# EAGLE design UnitedRefrigerator (EAGLE 9.0.1)
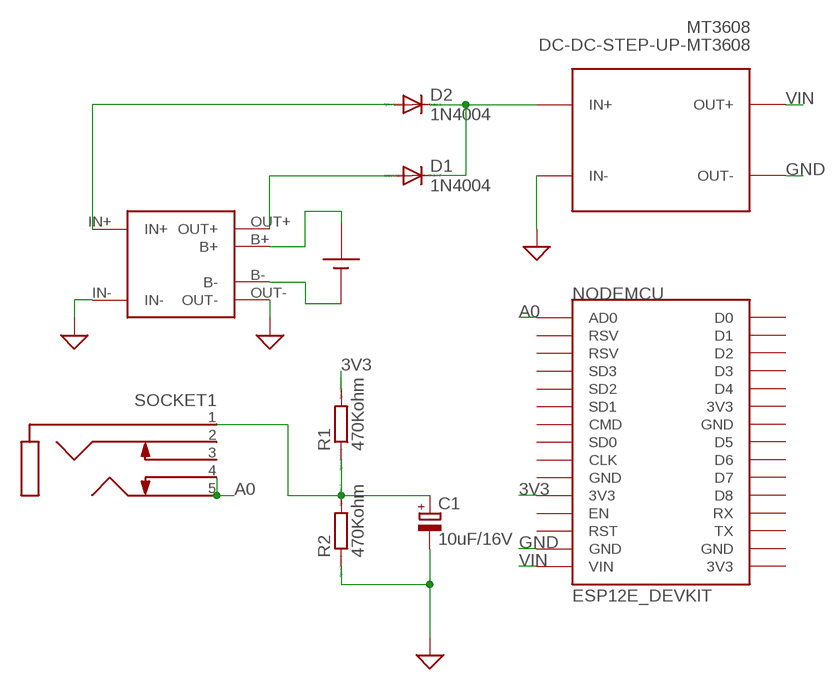
[diagram p0: schematic, sheet 1]

## Parts
C1  10uF/16V  CPOL-EUE2.5-6  [E2,5-6]
D1  1N4004  [DO41-10]
D2  1N4004  [DO41-10]
MT3608  DC-DC-STEP-UP-MT3608  [DC-DC-STEP-UP-MT3608]
NODEMCU  ESP12E_DEVKIT  [ESP12E_DEVKIT]
R1  470Kohm  R0204/7  [0204/7]
R2  470Kohm  R0204/7  [0204/7]
SOCKET1  STEREO_JACK3F07  [3.5AUDIO_3F07]
TP4056  TP4056-MODULE  [TP4056-LITHIUM-PROTECTED-MODULE]
U$3  18650CABLE  [18650-CASE-CABLE]

## Nets
3V3: NODEMCU.3V3@0(3V3) R1.2
A0: NODEMCU.AD0 SOCKET1.4(RSWITCH) SOCKET1.5(RING)
GND: C1.- MT3608.IN- MT3608.OUT- NODEMCU.GND@1(GND) R2.1 TP4056.IN- TP4056.OUT- ; supply symbol labelled SUP
N$1: C1.+ R1.1 R2.2 SOCKET1.1(SLEEVE)
N$3: TP4056.B- U$3.NEG
N$4: TP4056.B+ U$3.POS
N$5: D1.C D2.C MT3608.IN+
N$7: D2.A TP4056.IN+
N$8: D1.A TP4056.OUT+
VIN: MT3608.OUT+ NODEMCU.VIN
Unconnected: NODEMCU.3V3@1(3V3) NODEMCU.3V3@2(3V3) NODEMCU.CLK NODEMCU.CMD NODEMCU.D0 NODEMCU.D1 NODEMCU.D2 NODEMCU.D3 NODEMCU.D4 NODEMCU.D5 NODEMCU.D6 NODEMCU.D7 NODEMCU.D8 NODEMCU.EN NODEMCU.GND@0(GND) NODEMCU.GND@2(GND) NODEMCU.GND@3(GND) NODEMCU.RST NODEMCU.RSV@0(RSV) NODEMCU.RSV@1(RSV) NODEMCU.RX NODEMCU.SD0 NODEMCU.SD1 NODEMCU.SD2 NODEMCU.SD3 NODEMCU.TX SOCKET1.2(TIP) SOCKET1.3(TSWITCH)

## Library data of the parts
C1 = rcl:CPOL-EU: POLARIZED CAPACITOR, European symbol
D1 D2 = diode:1N4004: DIODE general purpose rectifier, 1 A
MT3608 = dc-dc-boost-2a-microusb-mt3608:DC-DC-STEP-UP-MT3608: DC/DC Step-Up Regulator based on MT3608 chip MT3608 datasheet available here: https://www.olimex.com/Products/Breadboarding/BB-PWR-3608/resources/MT3608.pdf Click here to find device on ebay.com <http://www.ebay.com/sch/mt3608+module>
NODEMCU = ESP12E_DEVKIT:ESP12E_DEVKIT: ESP12E DEVKIT BOARD
R1 R2 = eagle-ltspice:R: RESISTOR, European symbol; SPICEMODEL: NONE; SPICEPREFIX: R
SOCKET1 = bt_electromech:STEREO_JACK: 3.5mm Stereo Audio Jack with insert detect switches.
TP4056 = userlib:TP4056-MODULE
U$3 = userlib:18650: Lithium Ion 18650

## Net classes
0 default: width 0.635 mm, drill 0.508 mm, clearance 0.508 mm

## Board
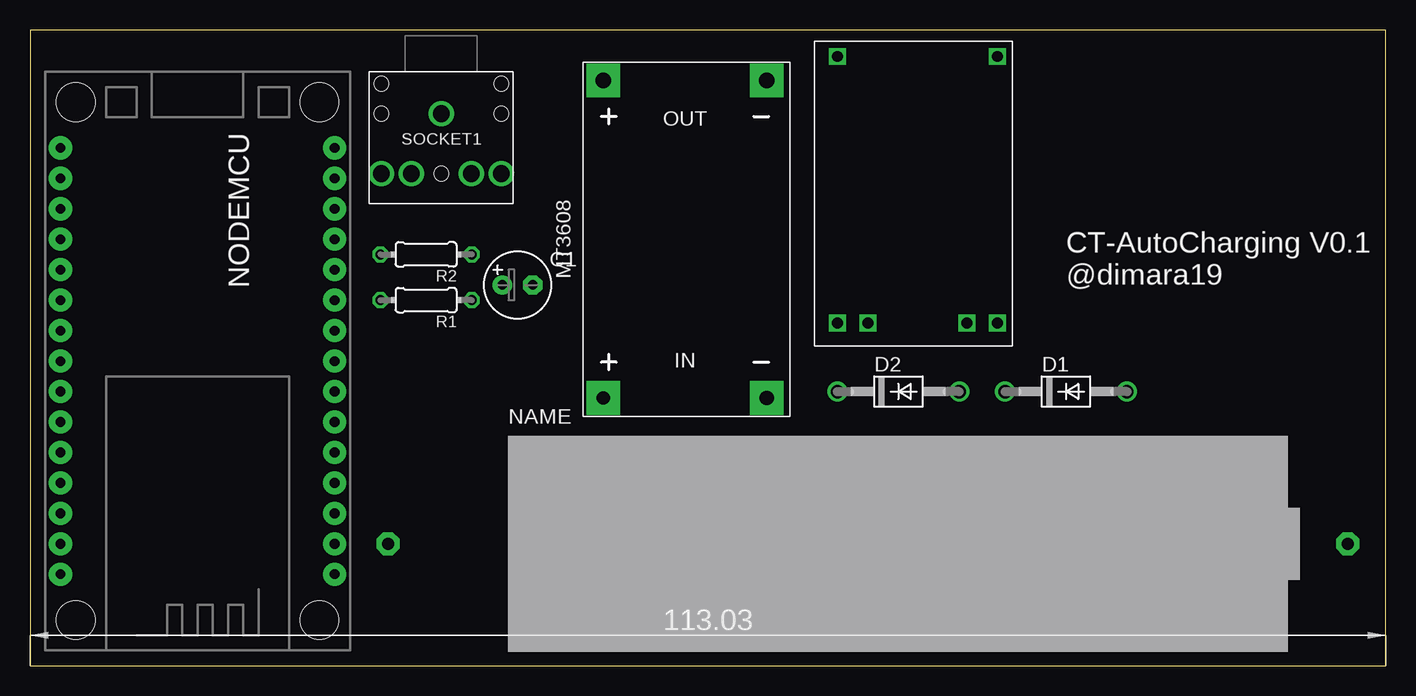
[diagram p1: board, top side]
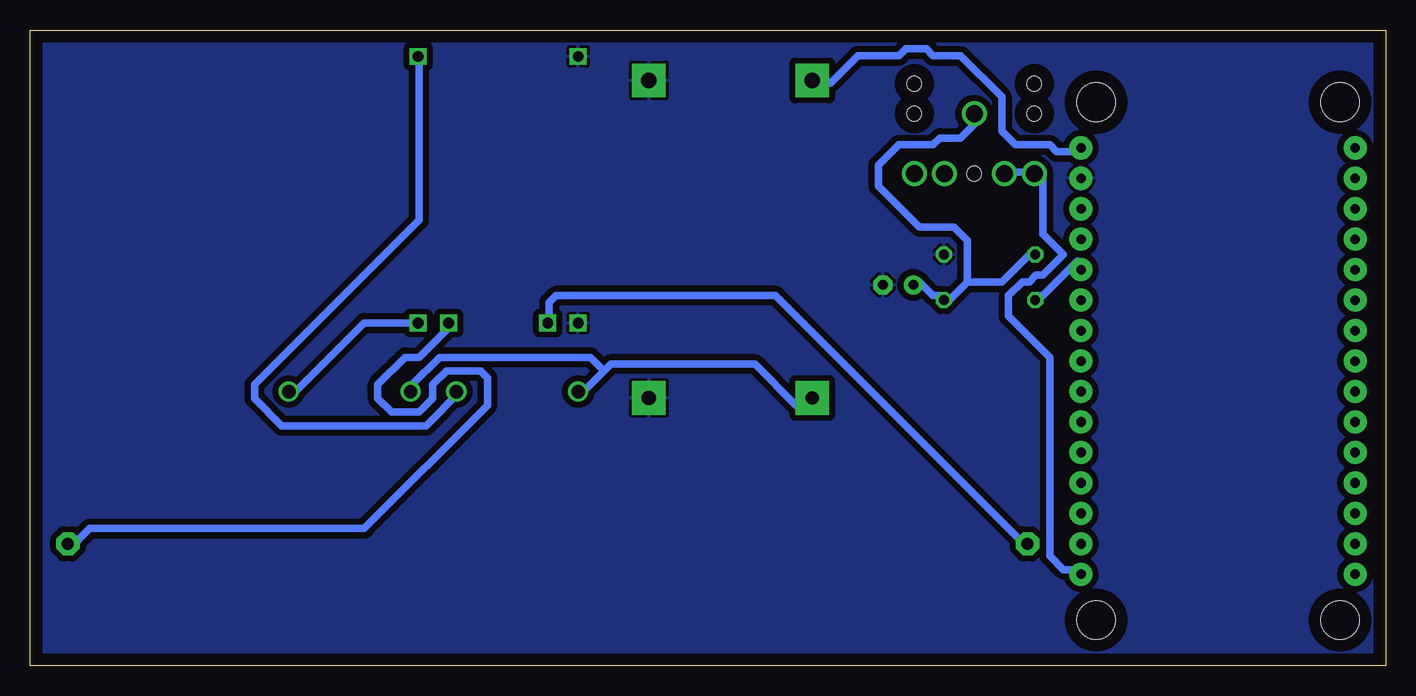
[diagram p2: board, bottom side, seen from below]

Size 113.01 x 53.01 mm. Coordinates in mm from the lower left corner, seen from the top.
Outline: 0,0 113.01,0 113.01,53.01 0,53.01 0,0
Copper layers (1*16): Top 0.035mm / dielectric 1.5mm / Bottom 0.035mm
Design rules "default": minimum track width 6mil, minimum drill 0.35mm, track to track 6mil, track to pad 6mil, pad to pad 6mil, via to via 6mil, smd to smd 6mil, copper to edge 40mil, drill to drill 6mil, minimum pad ring 10mil, minimum via ring 8mil, stop-mask expansion 4mil, vias tented up to drill 0mil, thermal gap 10mil

### Footprints (pad centres in the part's own frame; a part is rotated, then mirrored left to right if it is on the bottom)
E2,5-6 = drill 0.813 pad 1.6: + -1.27,0 | drill 0.813 pad 1.6 octagon: - 1.27,0
DO41-10 = drill 1.118: A 5.08,0; C -5.08,0
DC-DC-STEP-UP-MT3608 = drill 1.1 pad 2.8 square: IN+ -13.24,6.81 | drill 1.2 pad 2.8 square: IN- -13.24,-6.81 | drill 1.3 pad 2.8 square: OUT+ 13.24,6.81; OUT- 13.24,-6.81
ESP12E_DEVKIT = drill 0.8 pad 1.93: 3V3@0 -11.43,-7.62; 3V3@1 11.43,5.08; 3V3@2 11.43,-17.78; AD0 -11.43,17.78; CLK -11.43,-2.54; CMD -11.43,2.54; D0 11.43,17.78; D1 11.43,15.24; D2 11.43,12.7; D3 11.43,10.16; D4 11.43,7.62; D5 11.43,0; D6 11.43,-2.54; D7 11.43,-5.08; D8 11.43,-7.62; EN -11.43,-10.16; GND@0 -11.43,-5.08; GND@1 -11.43,-15.24; GND@2 11.43,2.54; GND@3 11.43,-15.24; RST -11.43,-12.7; RSV@0 -11.43,15.24; RSV@1 -11.43,12.7; RX 11.43,-10.16; SD0 -11.43,0; SD1 -11.43,5.08; SD2 -11.43,7.62; SD3 -11.43,10.16; TX 11.43,-12.7; VIN -11.43,-17.78 | hole 3.2: -10.16,21.59; 10.16,21.59; 10.16,-21.59; -10.16,-21.59
0204/7 = drill 0.813 octagon: 1 -3.81,0; 2 3.81,0
3.5AUDIO_3F07 = drill 1.4: 1 0,3.5; 2 -5,8.5; 3 -2.5,8.5; 4 2.5,8.5; 5 5,8.5 | hole 1.2: -5,3.5; -5,1; 5,1; 5,3.5; 0,8.5
TP4056-LITHIUM-PROTECTED-MODULE = drill 0.9 square: B+ 10.795,4.445; B- 10.795,-3.81; IN+ -11.43,6.985; IN- -11.43,-6.35; OUT+ 10.795,6.985; OUT- 10.795,-6.35
18650-CASE-CABLE = drill 1 pad 1.93 octagon: NEG -40,0; POS 40,0

### Placement (x,y rotation side)
C1  40.64,31.75 0 top
D1  86.36,22.86 0 top
D2  72.39,22.86 0 top
MT3608  54.61,35.56 90 top
NODEMCU  13.97,25.4 180 top
R1  33.02,30.48 180 top
R2  33.02,34.29 180 top
SOCKET1  34.29,49.53 180 top
TP4056  73.66,39.37 270 top
U$3  69.85,10.16 0 top

### Tracks (layer width: path | path; a pad name or v marks a point on that pad's centre or on a via)
3V3
  Bottom 0.635: R1.2 29.15,30.86 28.57,30.86 25.72,33.72 25.15,33.15 NODEMCU.3V3@0
A0
  Bottom 0.635: NODEMCU.AD0 25.72,8 26.86,8 28,9.14 28,25.72 31.43,29.15 31.43,30.86 30.29,32 29.72,32 29.15,32.58 28.57,32.58 26.86,34.29 28.57,36.01 28.57,41.15 29.15,41.15 SOCKET1.5 29.72,41.15 31.43,41.15 SOCKET1.4
GND
  pour Bottom: -1.27,53.34 114.3,53.34 114.3,-1.27 -1.27,-1.27
N$1
  Bottom 0.635: C1.+ 38.86,32 37.72,30.86 37.15,30.86 R1.1 36.58,30.29 34.86,32 | 34.86,32 32,32 29.72,34.29 R2.2 | SOCKET1.1 34.29,45.15 35.43,44.01 37.15,44.01 37.72,43.43 40.58,43.43 42.29,41.72 42.29,40.01 38.86,36.58 36.01,36.58 34.86,35.43 34.86,32
N$3
  Bottom 0.635: TP4056.B- 69.72,28.57 69.72,30.29 69.15,30.86 50.86,30.86 30.29,10.29 U$3.NEG
N$4
  Bottom 0.635: TP4056.B+ 78.3,28.57 78.3,28 80.58,25.72 81.72,25.72 84.01,23.43 84.01,22.29 82.87,21.14 80.58,21.14 79.44,22.29 79.44,23.43 78.3,24.57 75.44,24.57 74.87,24 74.87,21.72 85.15,11.43 108.01,11.43 109.73,9.72 U$3.POS
N$5
  Bottom 0.635: 65.15,24.57 64.58,25.15 52.58,25.15 49.15,21.72 48.58,21.72 48.01,22.29 MT3608.IN+ | 65.15,24.57 66.86,22.86 D2.C | 65.15,24.57 66.29,25.72 78.87,25.72 81.15,23.43 81.15,22.86 D1.C
N$7
  Bottom 0.635: TP4056.IN+ 80.58,50.29 80.58,37.15 94.3,23.43 94.3,22.29 92.01,20 80.01,20 77.15,22.86 D2.A
N$8
  Bottom 0.635: TP4056.OUT+ 85.15,28.57 90.87,22.86 D1.A
VIN
  Bottom 0.635: NODEMCU.VIN 25.72,42.86 27.43,42.86 28,43.43 30.86,43.43 32,44.58 32,47.43 35.43,50.86 37.72,50.86 38.29,51.44 40.01,51.44 40.58,50.86 44.01,50.86 46.29,48.58 47.43,48.58 MT3608.OUT+

### Text on the board
tNames: CT-AutoCharging V0.1 / @dimara19